# Altium project nfc-epd.PrjPcb
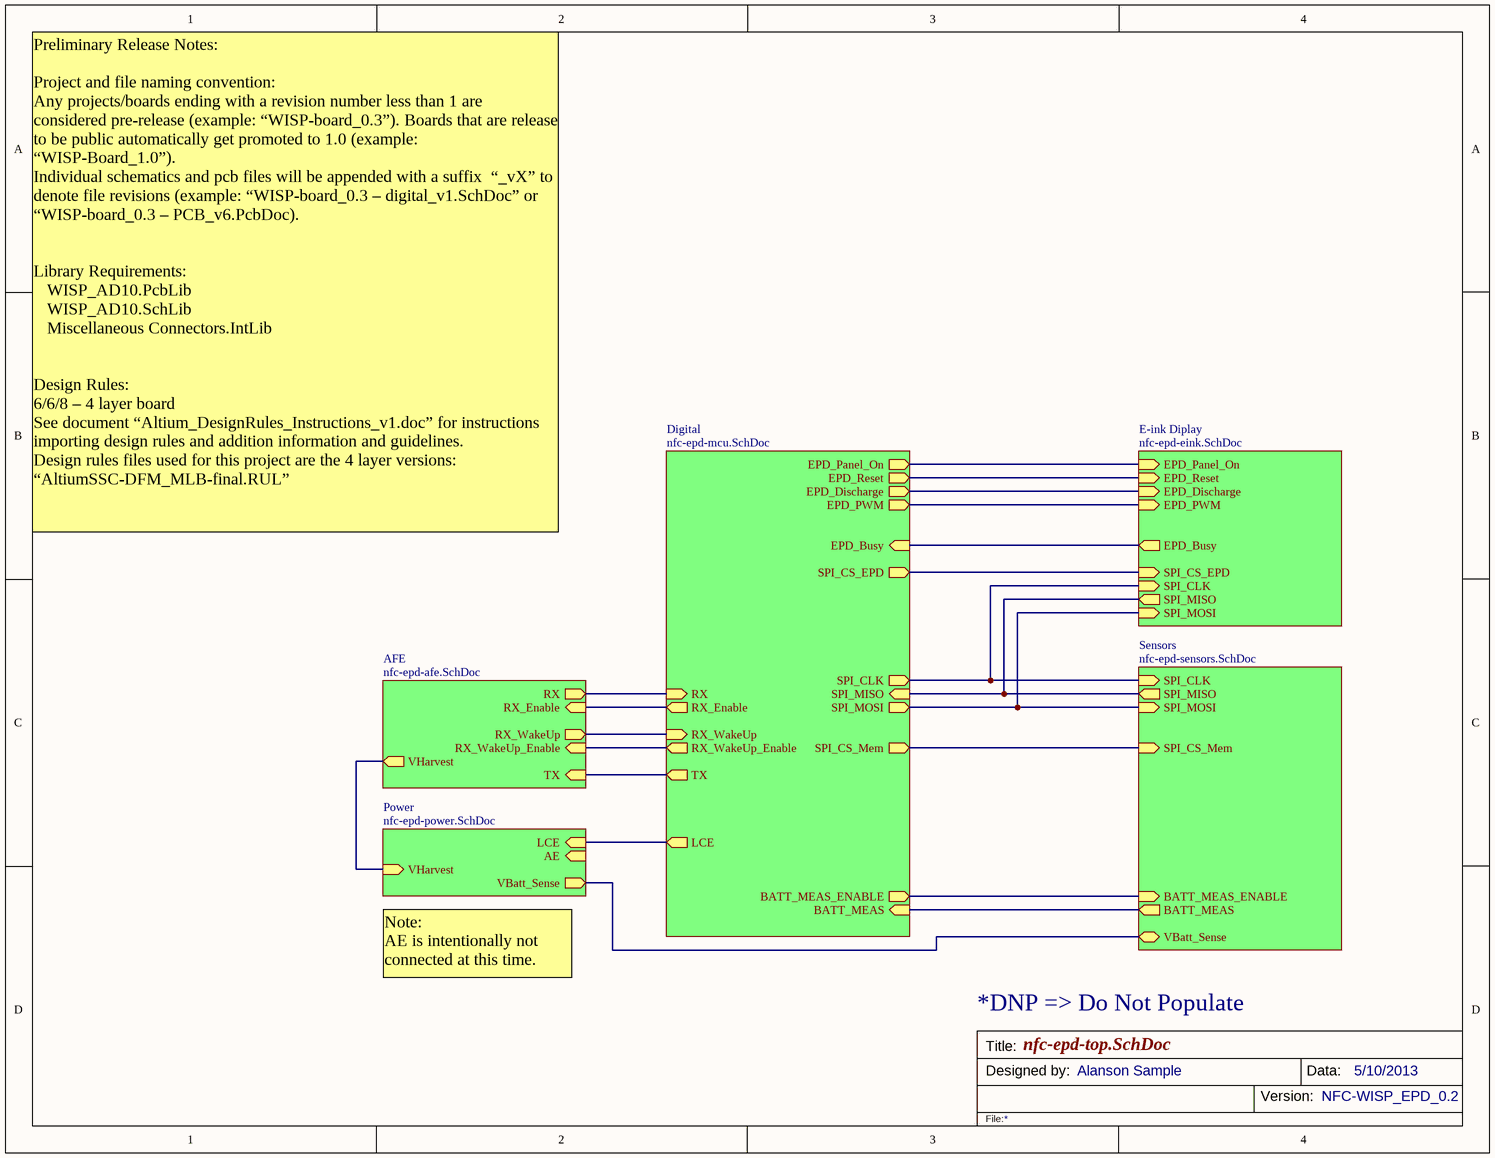
[diagram p0: nfc-epd-top.SchDoc]
6 sheets, 111 parts. Net scope: hierarchical (ports join the sheet entries above them; power ports are global).
Board file: nfc-epd.PcbDoc
Sheets:
  nfc-epd-top.SchDoc
    Digital = nfc-epd-mcu.SchDoc
    Sensors = nfc-epd-sensors.SchDoc
    Power = nfc-epd-power.SchDoc
    AFE = nfc-epd-afe.SchDoc
    E-ink Diplay = nfc-epd-eink.SchDoc

## Sheet nfc-epd-top.SchDoc
size Letter

### Sub-sheets
AFE = nfc-epd-afe.SchDoc: RX (out), TX (in), RX_Enable (in), RX_WakeUp (out), RX_WakeUp_Enable (in), VHarvest (out)
Digital = nfc-epd-mcu.SchDoc: RX (in), TX (out), RX_Enable (out), SPI_MOSI (out), SPI_MISO (in), SPI_CLK (out), RX_WakeUp (in), RX_WakeUp_Enable (out), LCE (out), BATT_MEAS_ENABLE (out), BATT_MEAS (in), SPI_CS_EPD (out), EPD_Busy (in), EPD_Reset (out), EPD_Panel_On (out), EPD_Discharge (out), EPD_PWM (out), SPI_CS_Mem (out)
E-ink Diplay = nfc-epd-eink.SchDoc: SPI_CS_EPD (in), EPD_Busy (out), SPI_CLK (in), SPI_MOSI (in), SPI_MISO (out), EPD_Reset (in), EPD_Panel_On (in), EPD_Discharge (in), EPD_PWM (in)
Power = nfc-epd-power.SchDoc: LCE (in), AE (in), VBatt_Sense, VHarvest (in)
Sensors = nfc-epd-sensors.SchDoc: VBatt_Sense, BATT_MEAS_ENABLE (in), BATT_MEAS (out), SPI_MOSI (in), SPI_MISO (out), SPI_CS_Mem (in), SPI_CLK (in)

### Nets
BATT_MEAS: sheet Digital/BATT_MEAS, sheet Sensors/BATT_MEAS
BATT_MEAS_ENABLE: sheet Digital/BATT_MEAS_ENABLE, sheet Sensors/BATT_MEAS_ENABLE
EPD_Busy: sheet Digital/EPD_Busy, sheet E-ink Diplay/EPD_Busy
EPD_Discharge: sheet Digital/EPD_Discharge, sheet E-ink Diplay/EPD_Discharge
EPD_Panel_On: sheet Digital/EPD_Panel_On, sheet E-ink Diplay/EPD_Panel_On
EPD_PWM: sheet Digital/EPD_PWM, sheet E-ink Diplay/EPD_PWM
EPD_Reset: sheet Digital/EPD_Reset, sheet E-ink Diplay/EPD_Reset
LCE: sheet Digital/LCE, sheet Power/LCE
RX: sheet Digital/RX, sheet AFE/RX
RX_Enable: sheet Digital/RX_Enable, sheet AFE/RX_Enable
RX_WakeUp: sheet Digital/RX_WakeUp, sheet AFE/RX_WakeUp
RX_WakeUp_Enable: sheet Digital/RX_WakeUp_Enable, sheet AFE/RX_WakeUp_Enable
SPI_CLK: sheet Digital/SPI_CLK, sheet Sensors/SPI_CLK, sheet E-ink Diplay/SPI_CLK
SPI_CS_EPD: sheet Digital/SPI_CS_EPD, sheet E-ink Diplay/SPI_CS_EPD
SPI_CS_Mem: sheet Digital/SPI_CS_Mem, sheet Sensors/SPI_CS_Mem
SPI_MISO: sheet Digital/SPI_MISO, sheet Sensors/SPI_MISO, sheet E-ink Diplay/SPI_MISO
SPI_MOSI: sheet Digital/SPI_MOSI, sheet Sensors/SPI_MOSI, sheet E-ink Diplay/SPI_MOSI
TX: sheet Digital/TX, sheet AFE/TX
VBatt_Sense: sheet Sensors/VBatt_Sense, sheet Power/VBatt_Sense
VHarvest: sheet Power/VHarvest, sheet AFE/VHarvest

### Notes on the sheet
- Preliminary Release Notes:
  Project and file naming convention:
  Any projects/boards ending with a revision number less than 1 are considered pre-release (example: “WISP-board_0.3”). Boards that are release to be public automatically get promoted to 1.0 (example: “WISP-Board_1.0”).
  Individual schematics and pcb files will be appended with a suffix  “_vX” to denote file revisions (example: “WISP-board_0.3 – digital_v1.SchDoc” or “WISP-board_0.3 – PCB_v6.PcbDoc).
  Library Requirements:
  WISP_AD10.PcbLib
  WISP_AD10.SchLib
  Miscellaneous Connectors.IntLib
  Design Rules:
  6/6/8 – 4 layer board
  See document “Altium_DesignRules_Instructions_v1.doc” for instructions importing design rules and addition information and guidelines.
  Design rules files used for this project are the 4 layer versions:  “AltiumSSC-DFM_MLB-final.RUL”
- Note:
  AE is intentionally not connected at this time.
- *DNP => Do Not Populate
- Title:
- Designed by:
- Alanson Sample
- Version:
- Data:
- NFC-WISP_EPD_0.2
- 5/10/2013
- File:

## Sheet nfc-epd-mcu.SchDoc
size Letter
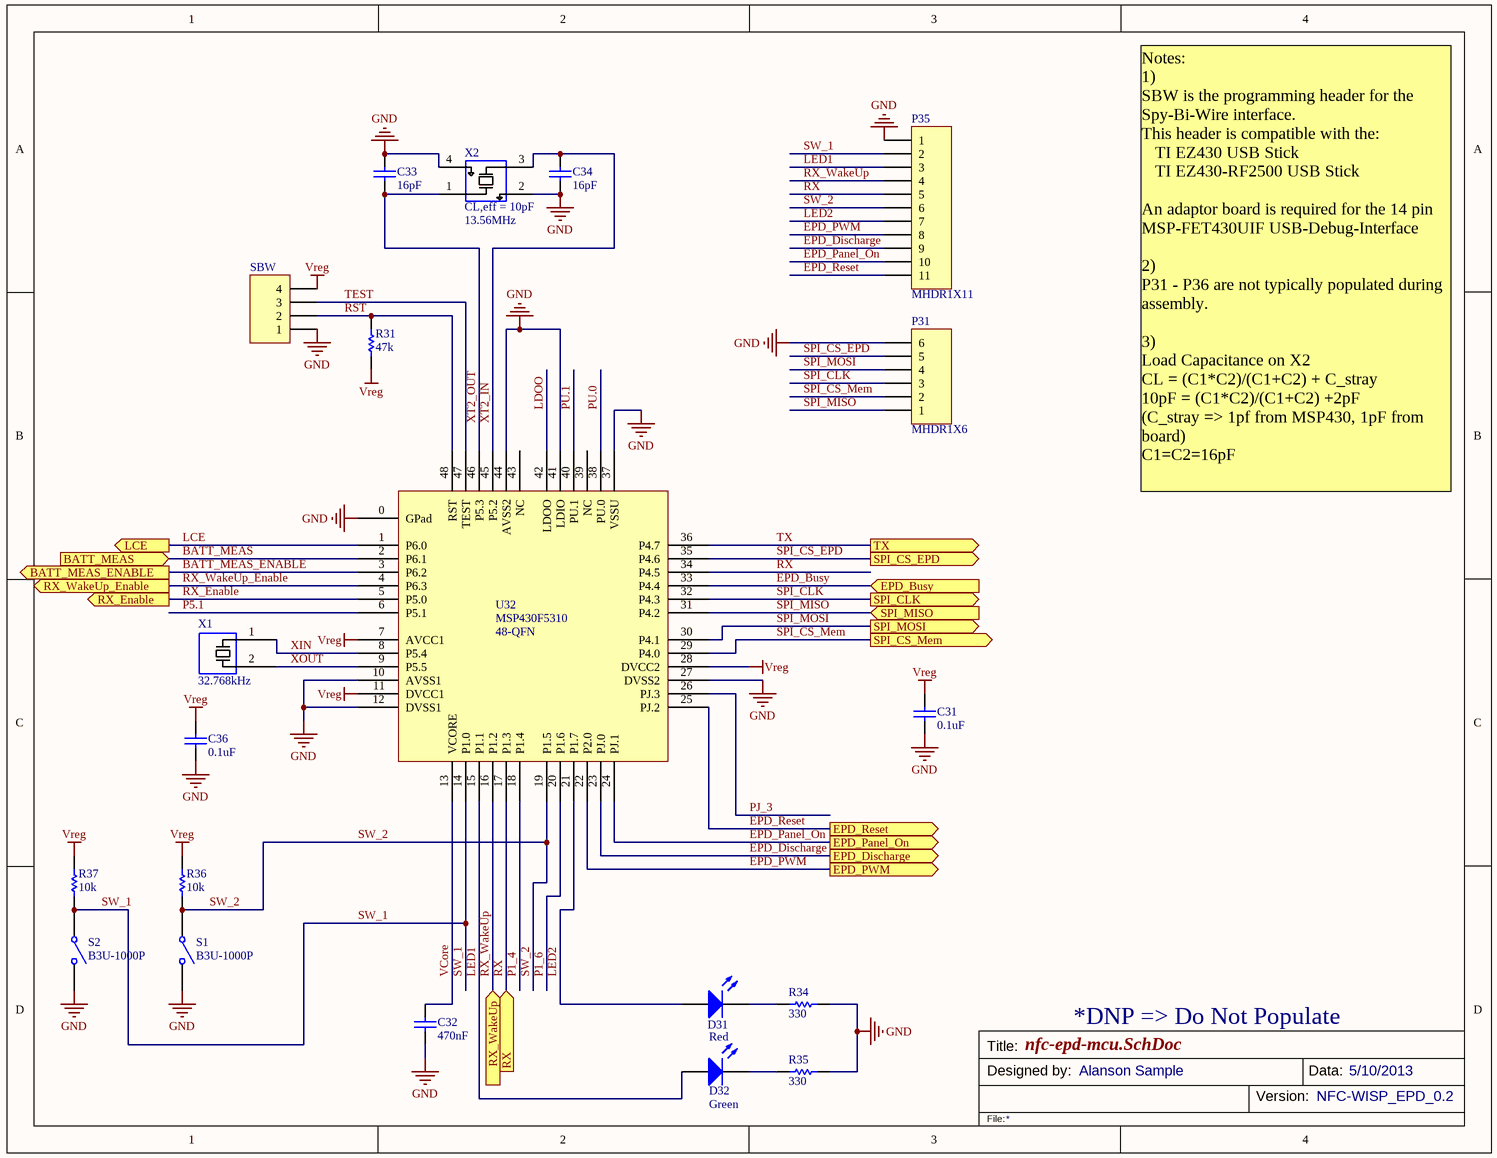
[diagram p1: nfc-epd-mcu.SchDoc]

### Parts
C31  value 0.1uF  [0603]  (hidden comment: Cap)
C32  value 470nF  [0603]  (hidden comment: Cap)
C33  value 16pF  [0603]  (hidden comment: Cap)
C34  value 16pF  [0603]  (hidden comment: Cap)
C36  value 0.1uF  [0402]  (hidden comment: Cap)
D31  value Red  [Diode - 0603]  (hidden comment: LED)
D32  value Green  [Diode - 0603]  (hidden comment: LED)
P31  MHDR1X6  [MHDR1X6]
P35  MHDR1X11  [MHDR1X11]
R31  value 47k  [0603]  (hidden comment: Res)
R34  value 330  [0603]  (hidden comment: Res)
R35  value 330  [0603]  (hidden comment: Res)
R36  value 10k  [0603]  (hidden comment: Res)
R37  value 10k  [0603]  (hidden comment: Res)
S1  B3U-1000P  [Switch - B3U-1000P]
S2  B3U-1000P  [Switch - B3U-1000P]
SBW  MHDR1X4  [MHDR1X4]  (value not drawn)
U32  MSP430F5310  [48-QFN]
X1  value 32.768kHz  [XTAL - 2Pin [3.2mm x 1.5mm]]  (hidden comment: XTAL)
X2  value 13.56MHz  Rating: CL,eff = 10pF  [XTAL - 4Pin [3.2MM X 2.5MM]]  (hidden comment: XTAL 4pin)

### Ports
BATT_MEAS (in), BATT_MEAS_ENABLE (out), EPD_Busy (in), EPD_Discharge (out), EPD_Panel_On (out), EPD_PWM (out), EPD_Reset (out), LCE (out), RX (in), RX_Enable (out), RX_WakeUp (in), RX_WakeUp_Enable (out), SPI_CLK (out), SPI_CS_EPD (out), SPI_CS_Mem (out), SPI_MISO (in), SPI_MOSI (out), TX (out)

### Nets
GND: C31.1 C32.2 C33.2 C34.1 C36.1 P31.6 P35.1 R34.1 R35.1 S1.2(NO) S2.2(NO) SBW.1 U32.0(GPad) U32.10(AVSS1) U32.12(DVSS1) U32.27(DVSS2) U32.37(VSSU) U32.41(LDIO) U32.44(AVSS2) X2.2(Gnd) X2.4(Gnd)
Vreg: C31.2 C36.2 R31.2 R36.2 R37.2 SBW.4 U32.7(AVCC1) U32.11(DVCC1) U32.28(DVCC2)
BATT_MEAS: U32.2(P6.1) ; port BATT_MEAS
BATT_MEAS_ENABLE: U32.3(P6.2) ; port BATT_MEAS_ENABLE
EPD_Busy: U32.33(P4.4) ; port EPD_Busy
EPD_Discharge: P35.9 U32.23(PJ.0) ; port EPD_Discharge
EPD_Panel_On: P35.10 U32.24(PJ.1) ; port EPD_Panel_On
EPD_PWM: P35.8 U32.22(P2.0) ; port EPD_PWM
EPD_Reset: P35.11 U32.25(PJ.2) ; port EPD_Reset
LCE: U32.1(P6.0) ; port LCE
LDOO: U32.42(LDOO)
LED1: D32.1(A) P35.3 U32.15(P1.1)
LED2: D31.1(A) P35.7 U32.21(P1.7)
P1_4: U32.18(P1.4)
P1_6: U32.20(P1.6)
P5.1: U32.6(P5.1)
PJ_3: U32.26(PJ.3)
PU.0: U32.38(PU.0)
PU.1: U32.40(PU.1)
RST: R31.1 SBW.2 U32.48(RST)
RX: P35.5 U32.17(P1.3) U32.34(P4.5) ; port RX
RX_Enable: U32.5(P5.0) ; port RX_Enable
RX_WakeUp: P35.4 U32.16(P1.2) ; port RX_WakeUp
RX_WakeUp_Enable: U32.4(P6.3) ; port RX_WakeUp_Enable
SPI_CLK: P31.3 U32.32(P4.3) ; port SPI_CLK
SPI_CS_EPD: P31.5 U32.35(P4.6) ; port SPI_CS_EPD
SPI_CS_Mem: P31.2 U32.29(P4.0) ; port SPI_CS_Mem
SPI_MISO: P31.1 U32.31(P4.2) ; port SPI_MISO
SPI_MOSI: P31.4 U32.30(P4.1) ; port SPI_MOSI
SW_1: P35.2 R37.1 S2.1(COMMON) U32.14(P1.0)
SW_2: P35.6 R36.1 S1.1(COMMON) U32.19(P1.5)
TEST: SBW.3 U32.47(TEST)
TX: U32.36(P4.7) ; port TX
VCore: C32.1 U32.13(VCORE)
XIN: U32.8(P5.4) X1.1
XOUT: U32.9(P5.5) X1.2
XT2_IN: C34.2 U32.45(P5.2) X2.3(XOUT)
XT2_OUT: C33.1 U32.46(P5.3) X2.1(XIN)
NetD31_2: D31.2(K) R34.2
NetD32_2: D32.2(K) R35.2

Not connected (* = marked no-connect by the designer): U32 39(NC) 43(NC)

### Notes on the sheet
- Notes:
  1)
  SBW is the programming header for the Spy-Bi-Wire interface.
  This header is compatible with the:
  TI EZ430 USB Stick
  TI EZ430-RF2500 USB Stick
  An adaptor board is required for the 14 pin MSP-FET430UIF USB-Debug-Interface
  2)
  P31 - P36 are not typically populated during assembly.
  3)
  Load Capacitance on X2
  CL = (C1*C2)/(C1+C2) + C_stray
  10pF = (C1*C2)/(C1+C2) +2pF
  (C_stray => 1pf from MSP430, 1pF from board)
  C1=C2=16pF
- *DNP => Do Not Populate
- Title:
- Designed by:
- Alanson Sample
- Version:
- Data:
- NFC-WISP_EPD_0.2
- 5/10/2013
- File:

### Library data of the parts
C31-C34 C36 = Cap: Ceramic Capacitor (Surface Mount); Manufacturer: Generic Ceramic Chip Cap (TBD); Digi-Key Part Number: *; Manufacturer Part Number: *; Note: *; Rating: *
D31 D32 = Diode - LED: Typical RED, GREEN, YELLOW, AMBER GaAs LED; Digi-Key Part Number: *; Manufacturer: *; Manufacturer Part Number: *; Note: *; Rating: *
P31 = MHDR1X6: Header, 6-Pin; LatestRevisionDate: 17-Jul-2002; LatestRevisionNote: Re-released for DXP Platform.; Publisher: Altium Limited
P35 = MHDR1X11: Header, 11-Pin; LatestRevisionDate: 17-Jul-2002; LatestRevisionNote: Re-released for DXP Platform.; Publisher: Altium Limited
R31 R34-R37 = Res: Chip Resistor (Surface Mount); Manufacturer: Generic Chip Res (TBD); Manufacturer Part Number: *; Digi-Key Part Number: *; Rating: *
S1 S2 = Switch - Generic SPST: Generic Single-Pole, Single-Throw Switch; Manufacturer: Omron Electronics Inc-EMC Div; Manufacturer Part Number: B3U-1000P-B; Digi-Key Part Number: SW1143CT-ND; Note: *; Value: *; Rating: *
SBW = MHDR1X4: Header, 4-Pin; LatestRevisionDate: 17-Jul-2002; LatestRevisionNote: Re-released for DXP Platform.; Publisher: Altium Limited
U32 = MSP430F5310 - 48Pin: MSP430 - 48LQFP or 48QFN; Manufacturer: Texas Instruments; Manufacturer Part Number: MSP430F5310 (IPTR or IRGZ); Digi-Key Part Number: 296-28193-2-ND or 296-28133-1-ND; Rating: *; Value: *; Note: 48-QFN
X1 = XTAL 2-pins: Crystal Oscillator - [3.20mm x 1.50mm]; Manufacturer: Epson Toyocom Corporation; Manufacturer Part Number: FC-135 32.7680KA-A3; Digi-Key Part Number: example: SE2413CT-ND
X2 = XTAL 4-pins: Crystal - 4-Pin Surface Mount; Manufacturer Part Number: ABM8G-13.560MHZ-B4Y-T; Manufacturer: Abracon Corporation; Digi-Key Part Number: 535-10286-1-ND

## Sheet nfc-epd-sensors.SchDoc
size A
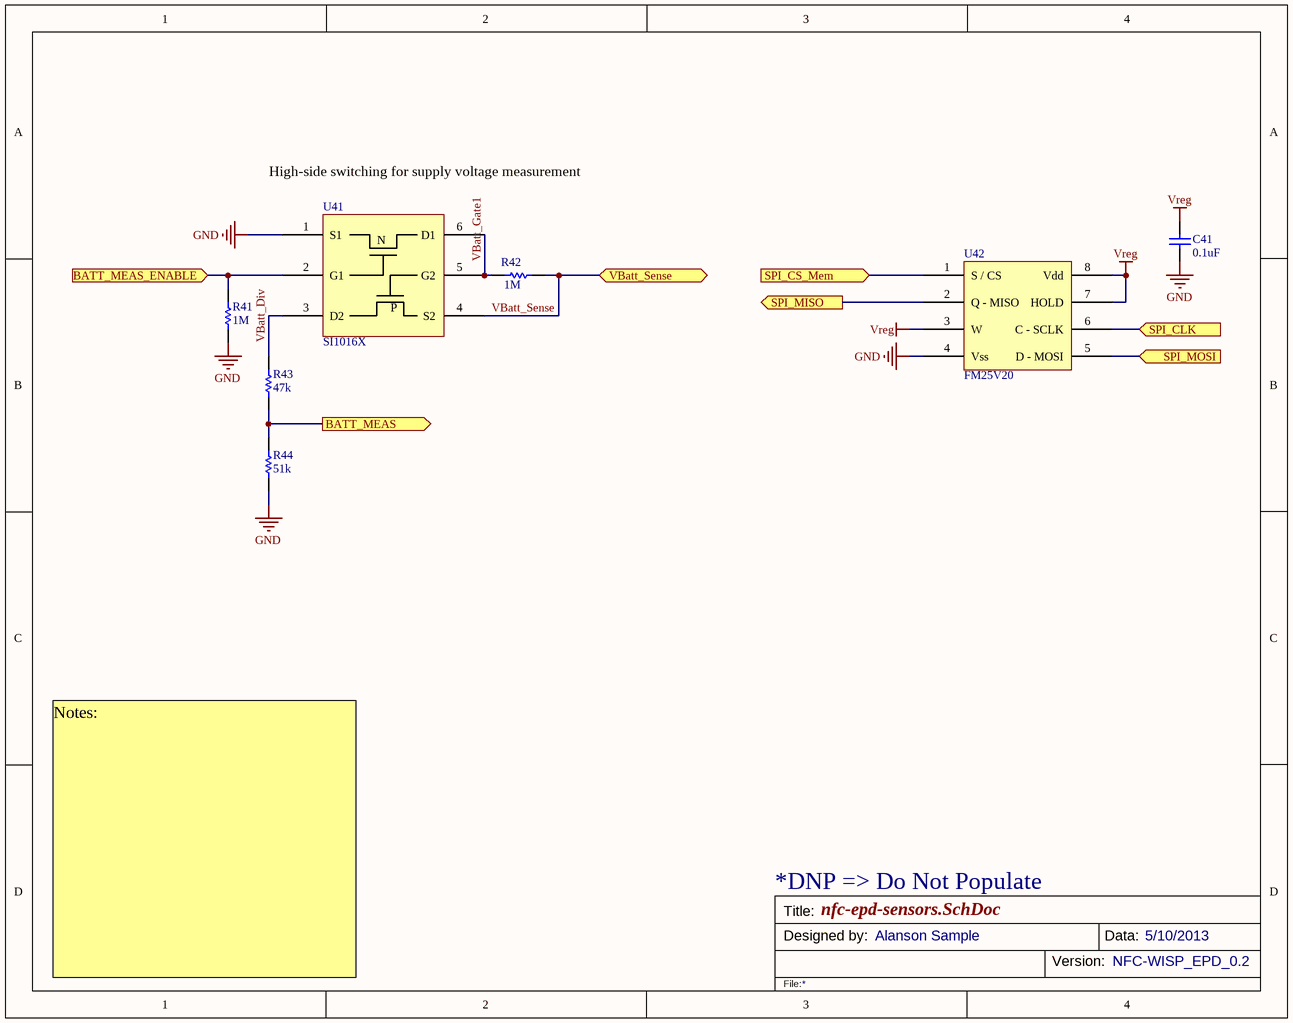
[diagram p2: nfc-epd-sensors.SchDoc]

### Parts
C41  value 0.1uF  [0603]  (hidden comment: Cap)
R41  value 1M  [0603]  (hidden comment: Res)
R42  value 1M  [0603]  (hidden comment: Res)
R43  value 47k  [0603]  (hidden comment: Res)
R44  value 51k  [0603]  (hidden comment: Res)
U41  SI1016X  [SC-89-6 Vishay]
U42  FM25V20  [TDFN-8]

### Ports
BATT_MEAS (out), BATT_MEAS_ENABLE (in), SPI_CLK (in), SPI_CS_Mem (in), SPI_MISO (out), SPI_MOSI (in), VBatt_Sense

### Nets
GND: C41.1 R41.1 R44.1 U41.1(S1) U42.4(Vss)
Vreg: C41.2 U42.3(W) U42.7(HOLD) U42.8(Vdd)
BATT_MEAS: R43.1 R44.2 ; port BATT_MEAS
BATT_MEAS_ENABLE: R41.2 U41.2(G1) ; port BATT_MEAS_ENABLE
SPI_CLK: U42.6(C_-_SCLK) ; port SPI_CLK
SPI_CS_Mem: U42.1(S_/_CS) ; port SPI_CS_Mem
SPI_MISO: U42.2(Q_-_MISO) ; port SPI_MISO
SPI_MOSI: U42.5(D_-_MOSI) ; port SPI_MOSI
VBatt_Div: R43.2 U41.3(D2)
VBatt_Gate1: R42.2 U41.5(G2) U41.6(D1)
VBatt_Sense: R42.1 U41.4(S2) ; port VBatt_Sense

### Notes on the sheet
- High-side switching for supply voltage measurement
- *DNP => Do Not Populate
- Notes:
- Title:
- Designed by:
- Alanson Sample
- Version:
- Data:
- NFC-WISP_EPD_0.2
- 5/10/2013
- File:
- (in symbol SI1016X) N; P

### Library data of the parts
C41 = Cap: as C31 on sheet nfc-epd-mcu; Digi-Key Part Number: *; Manufacturer Part Number: *; Note: *; Rating: *
R41-R44 = Res: as R31 on sheet nfc-epd-mcu; Manufacturer Part Number: *; Digi-Key Part Number: *; Rating: *
U41 = SI1016X: NMOS and PMOS array; Manufacturer: Vishay Siliconix; Manufacturer Part Number: SI1016X-T1-GE3; Digi-Key Part Number: SI1016X-T1-GE3CT-ND; Note: *; Value: *; Rating: *
U42 = FM25V20: 2 Mbit FRAM SPI; Manufacturer: Cypress Semiconductor Corp; Digi-Key Part Number: 428-3214-ND; Manufacturer Part Number: FM25V20; Rating: *; Note: *; Value: *

## Sheet nfc-epd-power.SchDoc
size A
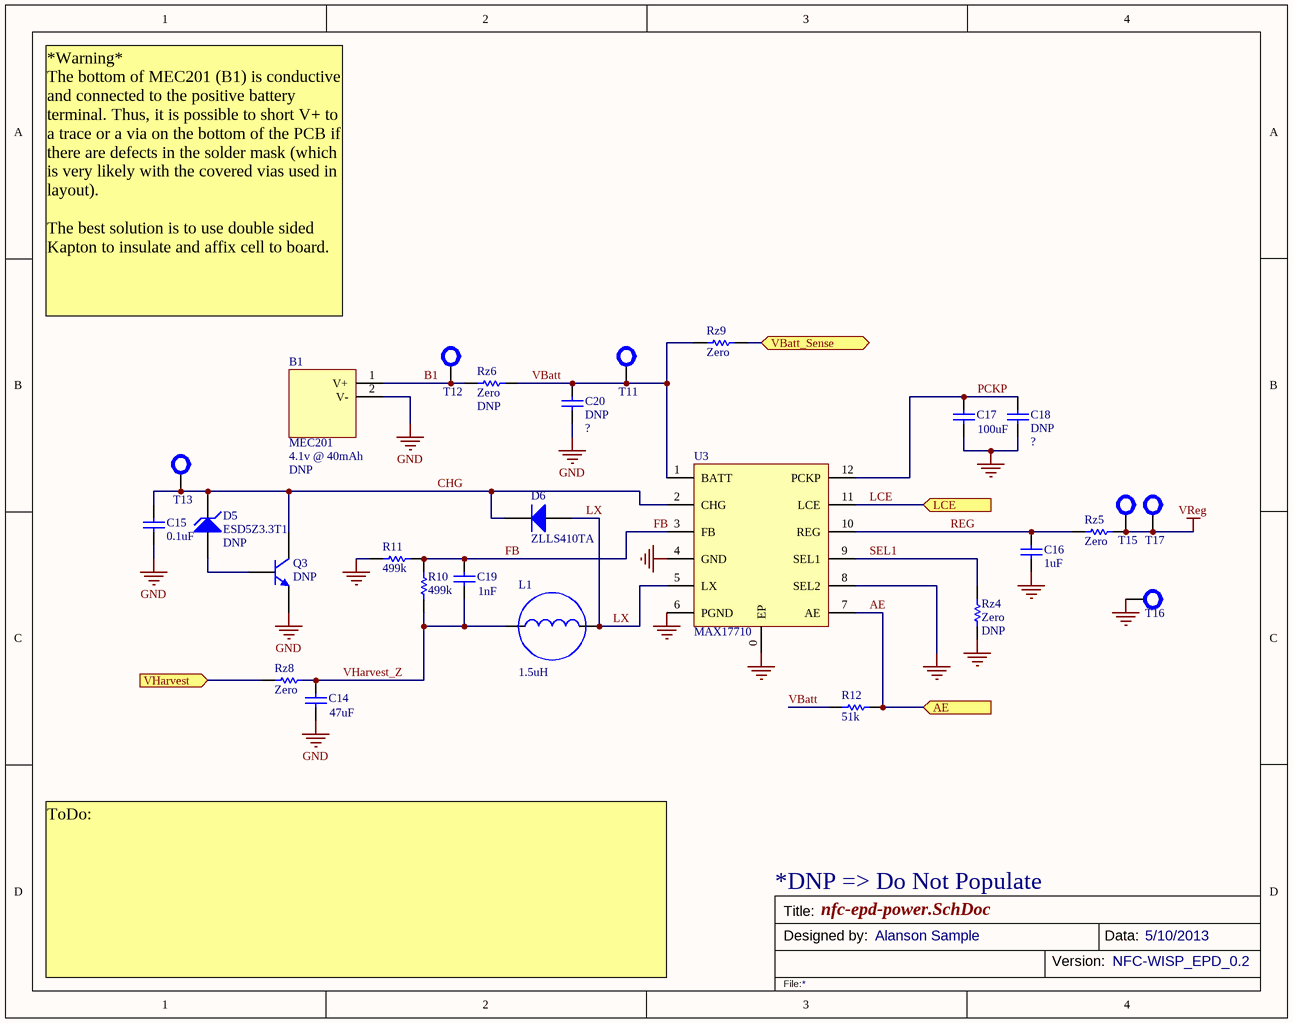
[diagram p3: nfc-epd-power.SchDoc]

### Parts
B1  MEC201  value 4.1v @ 40mAh  Note: DNP  [Battery - MEC201 - Caution]
C14  value 47uF  [0805]  (hidden comment: Cap)
C15  value 0.1uF  [0603]  (hidden comment: Cap)
C16  value 1uF  [0603]  (hidden comment: Cap)
C17  value 100uF  [1206]  (hidden comment: Cap)
C18  Note: DNP  [1206]  (hidden comment: Cap)
C19  value 1nF  [0603]  (hidden comment: Cap)
C20  Note: DNP  [1206]  (hidden comment: Cap)
D5  ESD5Z3.3T1  Note: DNP  [SOD-523]
D6  ZLLS410TA  [SOD-323]
L1  value 1.5uH  [Inductor - 1008]  (hidden comment: Ind - Power)
Q3  Note: DNP  [SOT-323 / SC-70]  (hidden comment: BJT - Generic)
R10  value 499k  [0603]  (hidden comment: Res)
R11  value 499k  [0603]  (hidden comment: Res)
R12  value 51k  [0603]  (hidden comment: Res)
Rz4  value Zero  Note: DNP  [0603]  (hidden comment: Res)
Rz5  value Zero  [0603]  (hidden comment: Res)
Rz6  value Zero  Note: DNP  [0603]  (hidden comment: Res)
Rz8  value Zero  [0603]  (hidden comment: Res)
Rz9  value Zero  [0603]  (hidden comment: Res)
T11  Test Point  [Test Point - Super Small]  (value not drawn)
T12  Test Point  [Test Point - Super Small]  (value not drawn)
T13  Test Point  [Test Point - Super Small]  (value not drawn)
T15  Test Point  [Test Point - Small]  (value not drawn)
T16  Test Point  [Test Point - Small]  (value not drawn)
T17  Test Point  [Test Point - Small]  (value not drawn)
U3  MAX17710  [MAX17710 - Wings]

### Ports
AE (in), LCE (in), VBatt_Sense, VHarvest (in)

### Nets
GND: B1.2(V-) C14.1 C15.2 C16.2 C17.1 C18.1 C20.2 Q3.2(E) R11.2 Rz4.2 T16.0 U3.0(EP) U3.4(GND) U3.6(PGND) U3.8(SEL2)
Vreg: Rz5.2 T15.0 T17.0
AE: R12.2 U3.7(AE) ; port AE
B1: B1.1(V+) Rz6.2 T12.0
CHG: C15.1 D5.1(C) D6.2(C) Q3.3(C) T13.0 U3.2(CHG)
FB: C19.2 R10.2 R11.1 U3.3(FB)
LCE: U3.11(LCE) ; port LCE
LX: D6.1(A) L1.2 U3.5(LX)
PCKP: C17.2 C18.2 U3.12(PCKP)
REG: C16.1 Rz5.1 U3.10(REG)
SEL1: Rz4.1 U3.9(SEL1)
VBatt: C20.1 R12.1 Rz6.1 Rz9.1 T11.0 U3.1(BATT)
VBatt_Sense: Rz9.2 ; port VBatt_Sense
VHarvest: Rz8.1 ; port VHarvest
VHarvest_Z: C14.2 C19.1 L1.1 R10.1 Rz8.2
NetD5_2: D5.2(A) Q3.1(B)

### Notes on the sheet
- *Warning*
  The bottom of MEC201 (B1) is conductive and connected to the positive battery terminal. Thus, it is possible to short V+ to a trace or a via on the bottom of the PCB if there are defects in the solder mask (which is very likely with the covered vias used in layout).
  The best solution is to use double sided Kapton to insulate and affix cell to board.
- *DNP => Do Not Populate
- ToDo:
- Title:
- Designed by:
- Alanson Sample
- Version:
- Data:
- NFC-WISP_EPD_0.2
- 5/10/2013
- File:

### Library data of the parts
B1 = Battery - MEC201: ThinFilm solid state battery  - 4.1V 1.0MAH; Manufacturer Part Number: MEC201-10S (several in same formfactor); Manufacturer: Infinite Power Solutions; Rating: *R; Digi-Key Part Number: MEC201-10SCT-ND (several in same formfactor)
C14 C16-C19 = Cap: Ceramic Capacitor (Surface Mount); Manufacturer: Generic Ceramic Chip Cap (TBD); Rating: 6V; Digi-Key Part Number: *; Manufacturer Part Number: *
  C14 C16 C17 C19: Note: *
  C18: Value: ?
C15 C20 = Cap: as C31 on sheet nfc-epd-mcu; Digi-Key Part Number: *; Manufacturer Part Number: *; Rating: *
  C15: Note: *
  C20: Value: ?
D5 = ESD5Z3.3T1: 5V Overvoltage Protection Zener; Manufacturer Part Number: ESD5Z3.3T1G; Manufacturer: ON Semiconductor; Digi-Key Part Number: ESD5Z3.3T1GOSCT-ND; Value: *; Rating: *
D6 = Diode: General Purpose Diode; Manufacturer: Diodes Inc; Manufacturer Part Number: ZLLS410TA; Digi-Key Part Number: ZLLS410CT-ND; Value: *; Rating: *; Note: *
L1 = Ind - Power: Power Inductor; Manufacturer: Murata Electronics North America; Manufacturer Part Number: LQM2HPN1R5MG0; Digi-Key Part Number: 490-5113-2-ND; Note: *; Rating: *
Q3 = BJT - Generic: Generic BJT; Digi-Key Part Number: *; Manufacturer: *; Manufacturer Part Number: *; Value: *; Rating: *
R10-R12 Rz4-Rz6 Rz8 Rz9 = Res: as R31 on sheet nfc-epd-mcu; Manufacturer Part Number: *; Digi-Key Part Number: *; Rating: *
  R10-R12: Note: *
T11-T13 T15-T17 = Test Point: Test Point, large or small foot prints; Manufacturer Part Number: Example: 5000, 5013; Manufacturer: Keystone Electronics; Note: *; Rating: *; Value: *
  T11-T13: Digi-Key Part Number: Example: 5000K-ND, 5012K-ND, Surface mount 5015KCT-ND
  T15-T17: Digi-key: Example: 5000K-ND, 5012K-ND
U3 = MAX17710: IC ENERGY HARVEST MNGR 12UTDFN; Manufacturer: Maxim Integrated; Manufacturer Part Number: MAX17710G+T; Digi-Key Part Number: MAX17710G+TCT-ND; Note: *; Value: *; Rating: *

## Sheet nfc-epd-afe.SchDoc
size Letter
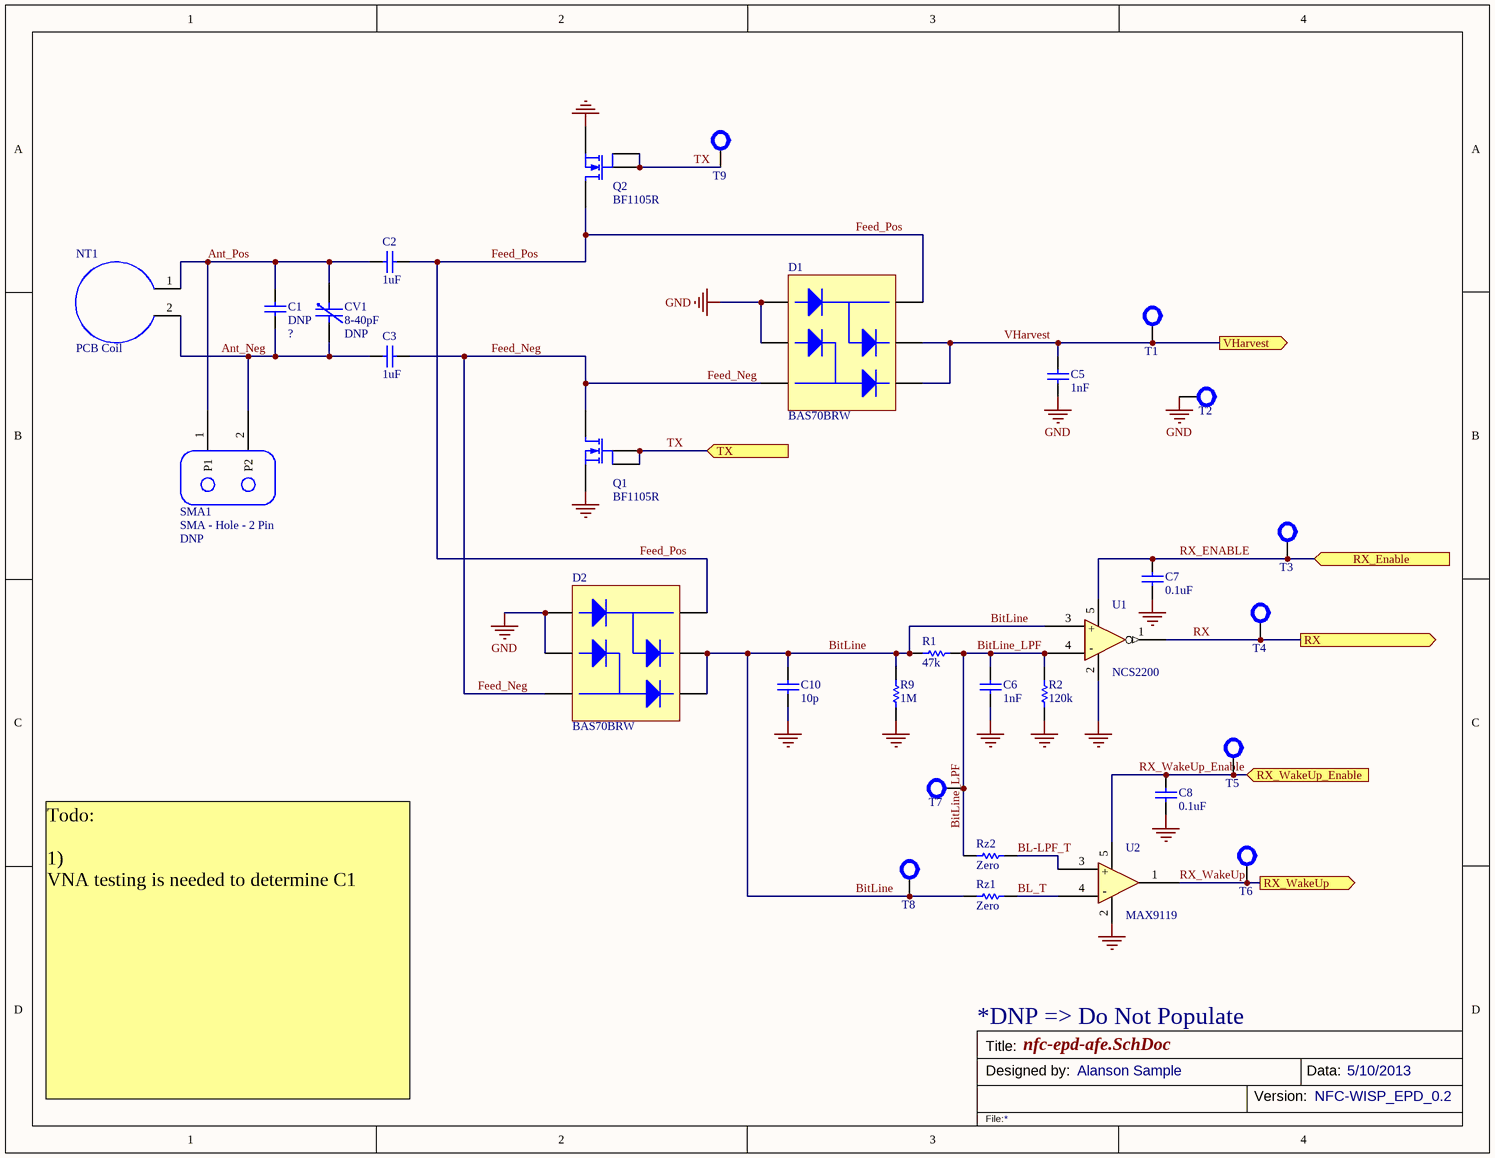
[diagram p4: nfc-epd-afe.SchDoc]

### Parts
C1  Note: DNP  [0603]  (hidden comment: Cap)
C2  value 1uF  [0603]  (hidden comment: Cap)
C3  value 1uF  [0603]  (hidden comment: Cap)
C5  value 1nF  [0603]  (hidden comment: Cap)
C6  value 1nF  [0603]  (hidden comment: Cap)
C7  value 0.1uF  [0603]  (hidden comment: Cap)
C8  value 0.1uF  [0603]  (hidden comment: Cap)
C10  value 10p  [0603]  (hidden comment: Cap)
CV1  value 8-40pF  Notes: DNP  [Var-Cap - GKY40056]  (hidden comment: GKY40056)
D1  BAS70BRW  [SOT-363]
D2  BAS70BRW  [SOT-363]
NT1  PCB Coil  [Net Tie - 50mil]  (net tie, no BOM)
Q1  BF1105R  [SOT-143R]
Q2  BF1105R  [SOT-143R]
R1  value 47k  [0603]  (hidden comment: Res)
R2  value 120k  [0603]  (hidden comment: Res)
R9  value 1M  [0603]  (hidden comment: Res)
Rz1  value Zero  [0603]  (hidden comment: Res)
Rz2  value Zero  [0603]  (hidden comment: Res)
SMA1  SMA - Hole - 2 Pin  Note: DNP  [SMA - Hole - 2 Pin]
T1  Test Point  [Test Point - Small]  (value not drawn)
T2  Test Point  [Test Point - Small]  (value not drawn)
T3  Test Point  [Test Point - Small]  (value not drawn)
T4  Test Point  [Test Point - Small]  (value not drawn)
T5  Test Point  [Test Point - Small]  (value not drawn)
T6  Test Point  [Test Point - Small]  (value not drawn)
T7  Test Point  [Test Point - Small]  (value not drawn)
T8  Test Point  [Test Point - Small]  (value not drawn)
T9  Test Point  [Test Point - Small]  (value not drawn)
U1  NCS2200  [SC70-5]
U2  MAX9119  [SC70-5]

### Ports
RX (out), RX_Enable (in), RX_WakeUp (out), RX_WakeUp_Enable (in), TX (in), VHarvest (out)

### Nets
GND: C5.2 C6.2 C7.2 C8.2 C10.2 D1.1(A1) D1.2(A2) D2.1(A1) D2.2(A2) Q1.1(S) Q2.1(S) R2.2 R9.2 T2.0 U1.2(Gnd) U2.2(VEE)
Ant_Neg: C1.2 C3.1 CV1.2 NT1.2(N2) SMA1.2(P2)
Ant_Pos: C1.1 C2.1 CV1.1 NT1.1(N1) SMA1.1(P1)
BitLine: C10.1 D2.4(C2) D2.5(C1) R1.1 R9.1 Rz1.1 T8.0 U1.3(IN+)
BitLine_LPF: C6.1 R1.2 R2.1 Rz2.1 T7.0 U1.4(In-)
BL-LPF_T: Rz2.2 U2.3(IN+)
BL_T: Rz1.2 U2.4(In-)
Feed_Neg: C3.2 D1.3(AC2) D2.3(AC2) Q1.2(D)
Feed_Pos: C2.2 D1.6(AC1) D2.6(AC1) Q2.2(D)
RX: T4.0 U1.1(OUT) ; port RX
RX_Enable: C7.1 T3.0 U1.5(VDD) ; port RX_Enable
RX_WakeUp: T6.0 U2.1(OUT) ; port RX_WakeUp
RX_WakeUp_Enable: C8.1 T5.0 U2.5(VCC) ; port RX_WakeUp_Enable
TX: Q1.3(G) Q1.4(G) Q2.3(G) Q2.4(G) T9.0 ; port TX
VHarvest: C5.1 D1.4(C2) D1.5(C1) T1.0 ; port VHarvest

### Notes on the sheet
- *DNP => Do Not Populate
- Todo:
  1)
  VNA testing is needed to determine C1
- Title:
- Designed by:
- Alanson Sample
- Version:
- Data:
- NFC-WISP_EPD_0.2
- 5/10/2013
- File:
- (in symbol MAX9119) +; -
- (in symbol NCS2200) +; -

### Library data of the parts
C1-C3 C5-C8 C10 = Cap: as C31 on sheet nfc-epd-mcu; Digi-Key Part Number: *; Manufacturer Part Number: *; Rating: *
  C1: Value: ?
  C2 C3 C5-C8 C10: Note: *
CV1 = Var-Cap/603: Var-Cap Sprague-Goodman GKY40056; Digi-Key Part Number: SG9013CT-ND; Manufacturer Part Number: GKY40056; Manufacturer: Sprague-Goodman; Rating: *
D1 D2 = Diode - Array_2: Diode Array - 2 Pair Series Connection; Manufacturer: Diodes Inc; Manufacturer Part Number: BAS70BRW-7-F; Note: *; Digi-Key Part Number: BAS70BRW-7FDICT-ND; Value: *; Rating: *
NT1 = Net Tie - Coil: Hand draw coil symbol based on a 'Net Tie'; Note: A Net Tie is an element that allows two differnt nets to be connected (shorted) together.
Q1 Q2 = BF1105R: SOT-143R, N-Channel Dual-Gate Mos-Fets MOSFET; Manufacturer Part Number: BF1105R,215; Manufacturer: NXP Semiconductors; Digi-Key Part Number: BF1105R,215-ND; Rating: *; Value: *; Note: *
R1 R2 R9 Rz1 Rz2 = Res: as R31 on sheet nfc-epd-mcu; Manufacturer Part Number: *; Digi-Key Part Number: *; Rating: *
SMA1 = SMA - Hole - 2 Pin: Two pin SMA connector wisp
T1-T9 = Test Point: as T11 on sheet nfc-epd-power; Digi-Key Part Number: Example: 5000K-ND, 5012K-ND, Surface mount 5015KCT-ND; Note: *; Rating: *; Value: *
U1 = NCS2200: Comparator: On Semi 10uA Comparator; Manufacturer: ON Semiconductor; Manufacturer Part Number: NCS2200SQ2T2G; Digi-Key Part Number: NCS2200SQ2T2GOSTR-ND; Rating: *; Value: *; Note: *
U2 = MAX9119: IC COMPARATOR BTR SC70-5, 350nA; Manufacturer: Maxim Integrated; Manufacturer Part Number: MAX9119EXK+T; Digi-Key Part Number: MAX9119EXK+TCT-ND; Rating: *; Value: *; Note: *

## Sheet nfc-epd-eink.SchDoc
size Letter
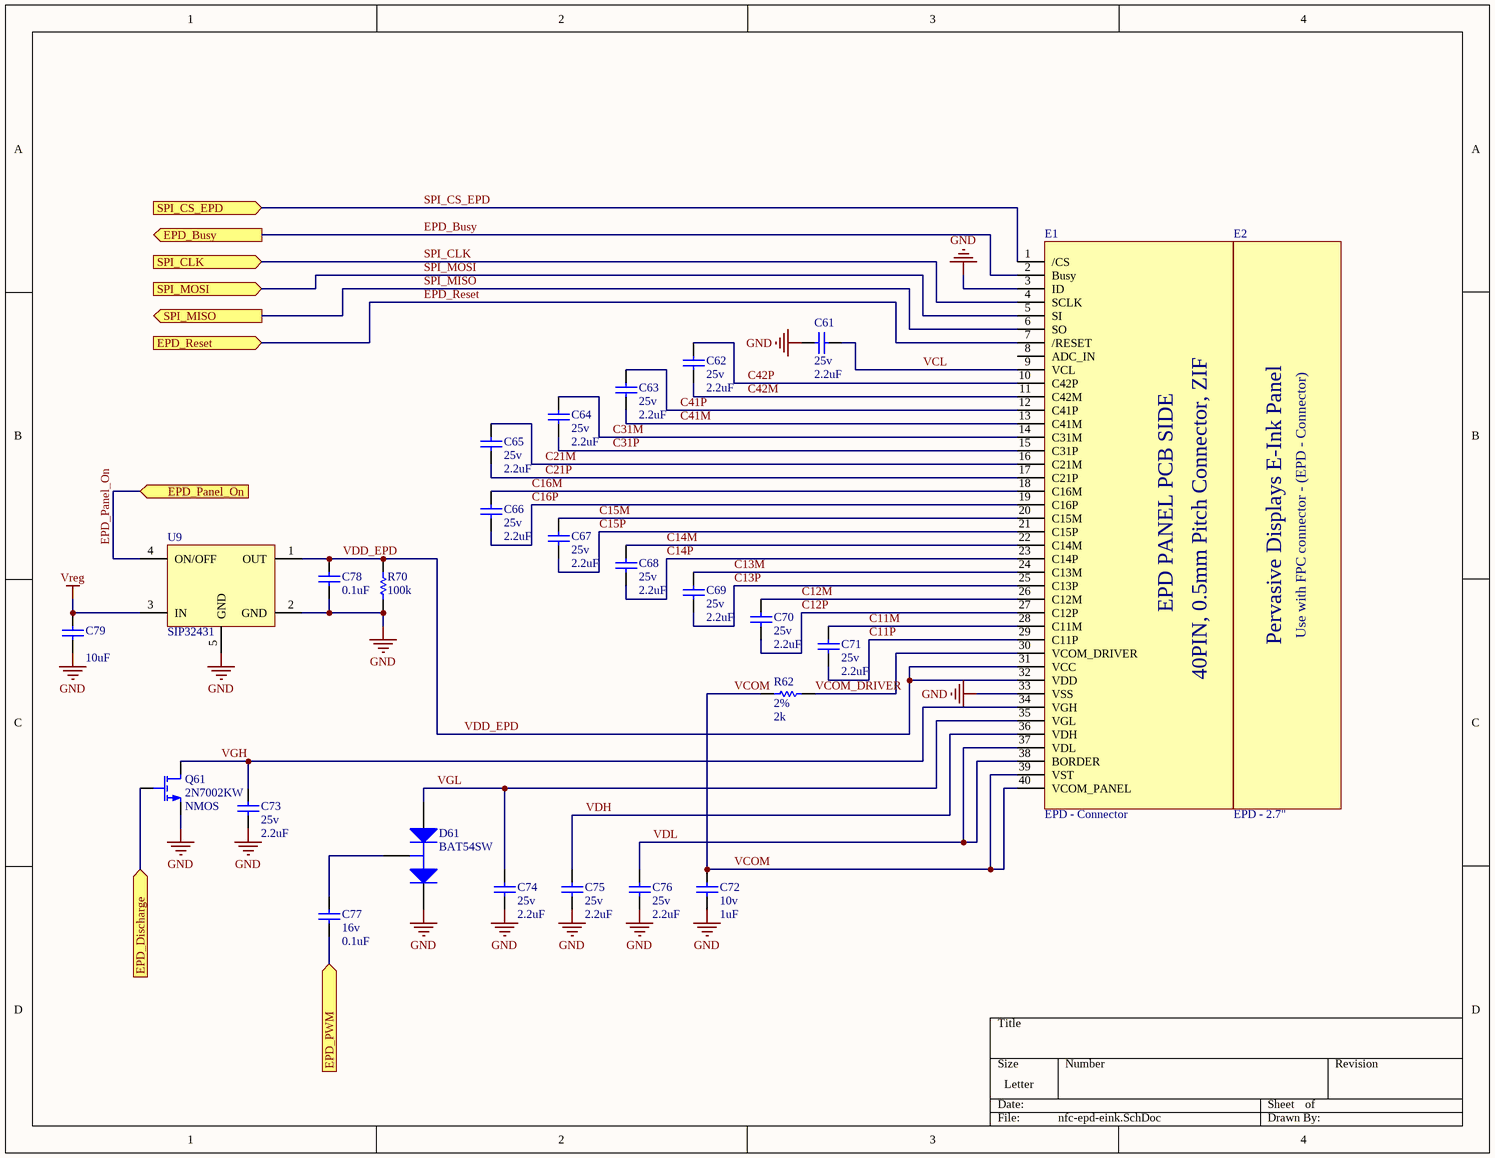
[diagram p5: nfc-epd-eink.SchDoc]

### Parts
C61  value 2.2uF  Rating: 25v  [0402]  (hidden comment: Cap)
C62  value 2.2uF  Rating: 25v  [0402]  (hidden comment: Cap)
C63  value 2.2uF  Rating: 25v  [0402]  (hidden comment: Cap)
C64  value 2.2uF  Rating: 25v  [0402]  (hidden comment: Cap)
C65  value 2.2uF  Rating: 25v  [0402]  (hidden comment: Cap)
C66  value 2.2uF  Rating: 25v  [0402]  (hidden comment: Cap)
C67  value 2.2uF  Rating: 25v  [0402]  (hidden comment: Cap)
C68  value 2.2uF  Rating: 25v  [0402]  (hidden comment: Cap)
C69  value 2.2uF  Rating: 25v  [0402]  (hidden comment: Cap)
C70  value 2.2uF  Rating: 25v  [0402]  (hidden comment: Cap)
C71  value 2.2uF  Rating: 25v  [0402]  (hidden comment: Cap)
C72  value 1uF  Rating: 10v  [0603]  (hidden comment: Cap)
C73  value 2.2uF  Rating: 25v  [0603]  (hidden comment: Cap)
C74  value 2.2uF  Rating: 25v  [0603]  (hidden comment: Cap)
C75  value 2.2uF  Rating: 25v  [0603]  (hidden comment: Cap)
C76  value 2.2uF  Rating: 25v  [0603]  (hidden comment: Cap)
C77  value 0.1uF  Rating: 16v  [0603]  (hidden comment: Cap)
C78  value 0.1uF  [0603]  (hidden comment: Cap)
C79  value 10uF  [0603]  (hidden comment: Cap)
D61  BAT54SW  [SOT-323 / SC-70]
E1  EPD - Connector  [EPD - Connector]
E2  EPD - 2.7"  [EPD - EM027AS012]
Q61  2N7002KW  value NMOS  [SOT-323 / SC-70]
R62  value 2k  Rating: 2%  [0603]  (hidden comment: Res)
R70  value 100k  [0603]  (hidden comment: Res)
U9  SIP32431  [TDFN-4]

### Ports
EPD_Busy (out), EPD_Discharge (in), EPD_Panel_On (in), EPD_PWM (in), EPD_Reset (in), SPI_CLK (in), SPI_CS_EPD (in), SPI_MISO (out), SPI_MOSI (in)

### Nets
GND: C61.2 C72.1 C73.1 C74.1 C75.1 C76.1 C78.1 C79.1 D61.2(K) E1.3(ID) E1.33(VSS) Q61.2(S) R70.1 U9.2(GND) U9.5(GND)
Vreg: C79.2 U9.3(IN)
C11M: C71.2 E1.28(C11M)
C11P: C71.1 E1.29(C11P)
C12M: C70.1 E1.26(C12M)
C12P: C70.2 E1.27(C12P)
C13M: C69.2 E1.24(C13M)
C13P: C69.1 E1.25(C13P)
C14M: C68.2 E1.22(C14M)
C14P: C68.1 E1.23(C14P)
C15M: C67.2 E1.20(C15M)
C15P: C67.1 E1.21(C15P)
C16M: C66.2 E1.18(C16M)
C16P: C66.1 E1.19(C16P)
C21M: C65.2 E1.16(C21M)
C21P: C65.1 E1.17(C21P)
C31M: C64.2 E1.14(C31M)
C31P: C64.1 E1.15(C31P)
C41M: C63.1 E1.13(C41M)
C41P: C63.2 E1.12(C41P)
C42M: C62.2 E1.11(C42M)
C42P: C62.1 E1.10(C42P)
EPD_Busy: E1.2(Busy) ; port EPD_Busy
EPD_Discharge: Q61.1(G) ; port EPD_Discharge
EPD_Panel_On: U9.4(ON/OFF) ; port EPD_Panel_On
EPD_PWM: C77.1 ; port EPD_PWM
EPD_Reset: E1.7(/RESET) ; port EPD_Reset
SPI_CLK: E1.4(SCLK) ; port SPI_CLK
SPI_CS_EPD: E1.1(/CS) ; port SPI_CS_EPD
SPI_MISO: E1.6(SO) ; port SPI_MISO
SPI_MOSI: E1.5(SI) ; port SPI_MOSI
VCL: C61.1 E1.9(VCL)
VCOM: C72.2 E1.39(VST) E1.40(VCOM_PANEL) R62.2
VCOM_DRIVER: E1.30(VCOM_DRIVER) R62.1
VDD_EPD: C78.2 E1.31(VCC) E1.32(VDD) R70.2 U9.1(OUT)
VDH: C75.2 E1.36(VDH)
VDL: C76.2 E1.37(VDL) E1.38(BORDER)
VGH: C73.2 E1.34(VGH) Q61.3(D)
VGL: C74.2 D61.1(A) E1.35(VGL)
NetC77_2: C77.2 D61.3(C)

Not connected (* = marked no-connect by the designer): E1 8(ADC_IN)

### Notes on the sheet
- (in symbol EPD - Connector) EPD PANEL PCB SIDE; 40PIN, 0.5mm Pitch Connector, ZIF
- (in symbol EPD - Display EM027AS012) Pervasive Displays E-Ink Panel; Use with FPC connector - (EPD - Connector)

### Library data of the parts
C61-C79 = Cap: as C31 on sheet nfc-epd-mcu; Digi-Key Part Number: *; Manufacturer Part Number: *; Note: *
D61 = Diode - Array_1: Diode Array, Two in Series, Small Package SOT-323; Manufacturer: ON Semiconductor; Manufacturer Part Number: BAT54SWT1G; Note: *; Digi-Key Part Number: BAT54SWT1GOSCT-ND or (BAT54SW); Value: *; Rating: *
E1 = EPD - Connector: FPC, 40pin, 0.5mm Pitch - ZIF; Manufacturer: Hirose Electric Co Ltd; Manufacturer Part Number: FH12-40S-0.5SH or FH12S-40S-0.5SH; Digi-Key Part Number: HFJ140CT-ND or HFA140CT-ND; Note: *; Value: *; Rating: *
E2 = EPD - Display EM027AS012: 2.7" TFT EPD Panel, STARCONN 089H40 variant; Manufacturer: PERVASIVE DISPLAYS, INC; Notes: Use for alignment purposes. No solder pads in footprint.; Digi-Key Part Number: EA-LCD-009-ND (should find another supplyer); Manufacturer Part Number: EM027AS012; Rating: *; Value: *
Q61 = MOSFET-N: N-Channel MOSFET; Manufacturer: Fairchild Semiconductor; Digi-Key Part Number: 2N7002KWCT-ND; Manufacturer Part Number: 2N7002KW; Notes: *; Rating: *
R62 R70 = Res: as R31 on sheet nfc-epd-mcu; Manufacturer Part Number: *; Digi-Key Part Number: *; Note: *
  R70: Rating: *
U9 = SIP32431: High Sside Switch - 4TDFN package; Manufacturer: Vishay Siliconix; Manufacturer Part Number: SIP32431DNP3-T1GE4; Digi-Key Part Number: SIP32431DNP3-T1GE4CT-ND; Note: *; Value: *; Rating: *

## Nets that join several sheets
GND: nfc-epd-mcu (21 pins), nfc-epd-sensors (5 pins), nfc-epd-power (15 pins), nfc-epd-afe (16 pins), nfc-epd-eink (15 pins)
Vreg: nfc-epd-mcu (9 pins), nfc-epd-sensors (C41.2 U42.3 U42.7 U42.8), nfc-epd-power (Rz5.2 T15.0 T17.0), nfc-epd-eink (C79.2 U9.3)
BATT_MEAS: nfc-epd-mcu (U32.2), nfc-epd-sensors (R43.1 R44.2)
BATT_MEAS_ENABLE: nfc-epd-mcu (U32.3), nfc-epd-sensors (R41.2 U41.2)
EPD_Busy: nfc-epd-mcu (U32.33), nfc-epd-eink (E1.2)
EPD_Discharge: nfc-epd-mcu (P35.9 U32.23), nfc-epd-eink (Q61.1)
EPD_Panel_On: nfc-epd-mcu (P35.10 U32.24), nfc-epd-eink (U9.4)
EPD_PWM: nfc-epd-mcu (P35.8 U32.22), nfc-epd-eink (C77.1)
EPD_Reset: nfc-epd-mcu (P35.11 U32.25), nfc-epd-eink (E1.7)
LCE: nfc-epd-mcu (U32.1), nfc-epd-power (U3.11)
RX: nfc-epd-mcu (P35.5 U32.17 U32.34), nfc-epd-afe (T4.0 U1.1)
RX_Enable: nfc-epd-mcu (U32.5), nfc-epd-afe (C7.1 T3.0 U1.5)
RX_WakeUp: nfc-epd-mcu (P35.4 U32.16), nfc-epd-afe (T6.0 U2.1)
RX_WakeUp_Enable: nfc-epd-mcu (U32.4), nfc-epd-afe (C8.1 T5.0 U2.5)
SPI_CLK: nfc-epd-mcu (P31.3 U32.32), nfc-epd-sensors (U42.6), nfc-epd-eink (E1.4)
SPI_CS_EPD: nfc-epd-mcu (P31.5 U32.35), nfc-epd-eink (E1.1)
SPI_CS_Mem: nfc-epd-mcu (P31.2 U32.29), nfc-epd-sensors (U42.1)
SPI_MISO: nfc-epd-mcu (P31.1 U32.31), nfc-epd-sensors (U42.2), nfc-epd-eink (E1.6)
SPI_MOSI: nfc-epd-mcu (P31.4 U32.30), nfc-epd-sensors (U42.5), nfc-epd-eink (E1.5)
TX: nfc-epd-mcu (U32.36), nfc-epd-afe (5 pins)
VBatt_Sense: nfc-epd-sensors (R42.1 U41.4), nfc-epd-power (Rz9.2)
VHarvest: nfc-epd-power (Rz8.1), nfc-epd-afe (C5.1 D1.4 D1.5 T1.0)